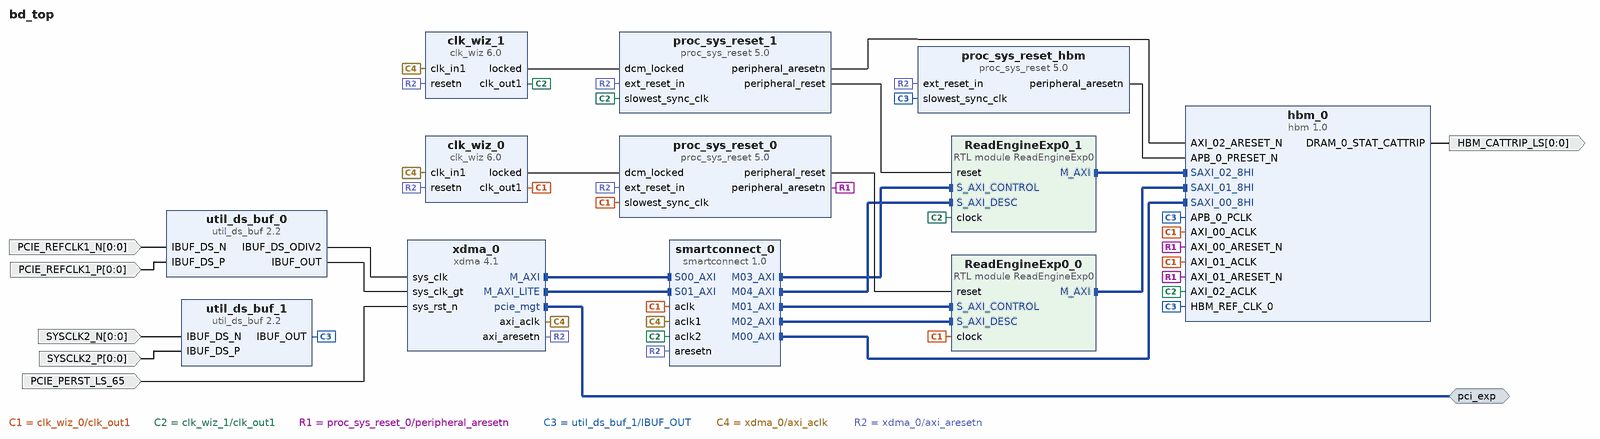
[diagram p0: block diagram of the top level]
# Vivado block design bd_top, xcu55c-fsvh2892-2L-e, Vivado 2024.1
create_bd_design bd_top

create_bd_intf_port -mode Master -vlnv xilinx.com:interface:pcie_7x_mgt_rtl:1.0 pci_exp
create_bd_port -dir I -from 0 -to 0 -type clk PCIE_REFCLK1_P
set_property -dict {CONFIG.ASSOCIATED_RESET PCIE_PERST} [get_bd_ports PCIE_REFCLK1_P]
create_bd_port -dir I -from 0 -to 0 -type clk PCIE_REFCLK1_N
create_bd_port -dir I -type rst PCIE_PERST_LS_65
create_bd_port -dir O -from 0 -to 0 HBM_CATTRIP_LS
create_bd_port -dir I -from 0 -to 0 -type clk SYSCLK2_P
create_bd_port -dir I -from 0 -to 0 -type clk SYSCLK2_N

create_bd_cell -type ip -vlnv xilinx.com:ip:clk_wiz:6.0 clk_wiz_0
set_property -dict [list \
  CONFIG.CLKIN1_JITTER_PS 40.0 \
  CONFIG.CLKOUT1_JITTER 104.289 \
  CONFIG.CLKOUT1_PHASE_ERROR 153.873 \
  CONFIG.CLKOUT1_REQUESTED_OUT_FREQ 450 \
  CONFIG.MMCM_CLKFBOUT_MULT_F 23.625 \
  CONFIG.MMCM_CLKIN1_PERIOD 4.000 \
  CONFIG.MMCM_CLKIN2_PERIOD 10.0 \
  CONFIG.MMCM_CLKOUT0_DIVIDE_F 2.625 \
  CONFIG.MMCM_DIVCLK_DIVIDE 5 \
  CONFIG.OPTIMIZE_CLOCKING_STRUCTURE_EN true \
  CONFIG.RESET_PORT resetn \
  CONFIG.RESET_TYPE ACTIVE_LOW \
] [get_bd_cells clk_wiz_0]
create_bd_cell -type ip -vlnv xilinx.com:ip:proc_sys_reset:5.0 proc_sys_reset_hbm
create_bd_cell -type ip -vlnv xilinx.com:ip:util_ds_buf:2.2 util_ds_buf_0
set_property -dict {CONFIG.C_BUF_TYPE IBUFDSGTE} [get_bd_cells util_ds_buf_0]
create_bd_cell -type ip -vlnv xilinx.com:ip:util_ds_buf:2.2 util_ds_buf_1
create_bd_cell -type ip -vlnv xilinx.com:ip:xdma:4.1 xdma_0
set_property -dict [list \
  CONFIG.PF0_DEVICE_ID_mqdma 902F \
  CONFIG.PF0_SRIOV_VF_DEVICE_ID A03F \
  CONFIG.PF2_DEVICE_ID_mqdma 922F \
  CONFIG.PF3_DEVICE_ID_mqdma 932F \
  CONFIG.axi_data_width 256_bit \
  CONFIG.axil_master_64bit_en true \
  CONFIG.axilite_master_en true \
  CONFIG.axilite_master_scale Megabytes \
  CONFIG.axilite_master_size 16 \
  CONFIG.axist_bypass_en false \
  CONFIG.axisten_freq 250 \
  CONFIG.cfg_mgmt_if false \
  CONFIG.pcie_blk_locn PCIE4C_X1Y0 \
  CONFIG.pcie_extended_tag true \
  CONFIG.pciebar2axibar_axil_master 0 \
  CONFIG.pf0_device_id 902F \
  CONFIG.pf0_link_status_slot_clock_config false \
  CONFIG.pf0_msi_cap_multimsgcap 1_vector \
  CONFIG.pf0_msi_enabled true \
  CONFIG.pf0_msix_enabled false \
  CONFIG.pl_link_cap_max_link_speed 5.0_GT/s \
  CONFIG.pl_link_cap_max_link_width X16 \
  CONFIG.plltype QPLL1 \
  CONFIG.xdma_num_usr_irq 16 \
] [get_bd_cells xdma_0]
create_bd_cell -type ip -vlnv xilinx.com:ip:smartconnect:1.0 smartconnect_0
set_property -dict {CONFIG.HAS_ARESETN 1 CONFIG.NUM_CLKS 3 CONFIG.NUM_MI 5} [get_bd_cells smartconnect_0]
create_bd_cell -type ip -vlnv xilinx.com:ip:hbm:1.0 hbm_0
set_property -dict [list \
  CONFIG.USER_APB_EN false \
  CONFIG.USER_CLK_SEL_LIST0 AXI_00_ACLK \
  CONFIG.USER_MC0_LOOKAHEAD_ACT false \
  CONFIG.USER_MC0_LOOKAHEAD_PCH false \
  CONFIG.USER_MC0_REORDER_EN false \
  CONFIG.USER_SAXI_01 true \
  CONFIG.USER_SAXI_02 true \
  CONFIG.USER_SAXI_03 false \
  CONFIG.USER_SAXI_04 false \
  CONFIG.USER_SAXI_05 false \
  CONFIG.USER_SAXI_06 false \
  CONFIG.USER_SAXI_07 false \
  CONFIG.USER_SAXI_08 false \
  CONFIG.USER_SAXI_09 false \
  CONFIG.USER_SAXI_10 false \
  CONFIG.USER_SAXI_11 false \
  CONFIG.USER_SAXI_12 false \
  CONFIG.USER_SAXI_13 false \
  CONFIG.USER_SAXI_14 false \
  CONFIG.USER_SAXI_15 false \
] [get_bd_cells hbm_0]
create_bd_cell -type module -reference ReadEngineExp0 ReadEngineExp0_0
create_bd_cell -type module -reference ReadEngineExp0 ReadEngineExp0_1
create_bd_cell -type ip -vlnv xilinx.com:ip:clk_wiz:6.0 clk_wiz_1
set_property -dict [list \
  CONFIG.CLKOUT1_JITTER 111.430 \
  CONFIG.CLKOUT1_REQUESTED_OUT_FREQ 300 \
  CONFIG.MMCM_CLKOUT0_DIVIDE_F 4.000 \
  CONFIG.RESET_PORT resetn \
  CONFIG.RESET_TYPE ACTIVE_LOW \
] [get_bd_cells clk_wiz_1]
create_bd_cell -type ip -vlnv xilinx.com:ip:proc_sys_reset:5.0 proc_sys_reset_0
create_bd_cell -type ip -vlnv xilinx.com:ip:proc_sys_reset:5.0 proc_sys_reset_1

# ---- connections ----

connect_bd_intf_net [get_bd_intf_pins hbm_0/SAXI_01_8HI] [get_bd_intf_pins ReadEngineExp0_0/M_AXI]
connect_bd_intf_net [get_bd_intf_pins ReadEngineExp0_1/M_AXI] [get_bd_intf_pins hbm_0/SAXI_02_8HI]
connect_bd_intf_net [get_bd_intf_pins smartconnect_0/M00_AXI] [get_bd_intf_pins hbm_0/SAXI_00_8HI]
connect_bd_intf_net [get_bd_intf_pins smartconnect_0/M01_AXI] [get_bd_intf_pins ReadEngineExp0_0/S_AXI_CONTROL]
connect_bd_intf_net [get_bd_intf_pins smartconnect_0/M02_AXI] [get_bd_intf_pins ReadEngineExp0_0/S_AXI_DESC]
connect_bd_intf_net [get_bd_intf_pins ReadEngineExp0_1/S_AXI_CONTROL] [get_bd_intf_pins smartconnect_0/M03_AXI]
connect_bd_intf_net [get_bd_intf_pins ReadEngineExp0_1/S_AXI_DESC] [get_bd_intf_pins smartconnect_0/M04_AXI]
connect_bd_intf_net [get_bd_intf_pins smartconnect_0/S00_AXI] [get_bd_intf_pins xdma_0/M_AXI]
connect_bd_intf_net [get_bd_intf_pins smartconnect_0/S01_AXI] [get_bd_intf_pins xdma_0/M_AXI_LITE]
connect_bd_intf_net [get_bd_intf_ports pci_exp] [get_bd_intf_pins xdma_0/pcie_mgt]
connect_bd_net -net IBUF_DS_N_0_1 [get_bd_ports PCIE_REFCLK1_N] [get_bd_pins util_ds_buf_0/IBUF_DS_N]
connect_bd_net -net IBUF_DS_N_0_2 [get_bd_ports SYSCLK2_N] [get_bd_pins util_ds_buf_1/IBUF_DS_N]
connect_bd_net -net IBUF_DS_P_0_1 [get_bd_ports PCIE_REFCLK1_P] [get_bd_pins util_ds_buf_0/IBUF_DS_P]
connect_bd_net -net IBUF_DS_P_0_2 [get_bd_ports SYSCLK2_P] [get_bd_pins util_ds_buf_1/IBUF_DS_P]
connect_bd_net [get_bd_pins clk_wiz_0/clk_out1] \
  [get_bd_pins smartconnect_0/aclk] [get_bd_pins hbm_0/AXI_00_ACLK] [get_bd_pins hbm_0/AXI_01_ACLK] \
  [get_bd_pins ReadEngineExp0_0/clock] [get_bd_pins proc_sys_reset_0/slowest_sync_clk]
connect_bd_net [get_bd_pins clk_wiz_0/locked] [get_bd_pins proc_sys_reset_0/dcm_locked]
connect_bd_net [get_bd_pins clk_wiz_1/clk_out1] \
  [get_bd_pins ReadEngineExp0_1/clock] [get_bd_pins proc_sys_reset_1/slowest_sync_clk] [get_bd_pins hbm_0/AXI_02_ACLK] \
  [get_bd_pins smartconnect_0/aclk2]
connect_bd_net [get_bd_pins clk_wiz_1/locked] [get_bd_pins proc_sys_reset_1/dcm_locked]
connect_bd_net [get_bd_pins hbm_0/DRAM_0_STAT_CATTRIP] [get_bd_ports HBM_CATTRIP_LS]
connect_bd_net -net proc_sys_reset_0_peripheral_aresetn [get_bd_pins proc_sys_reset_hbm/peripheral_aresetn] [get_bd_pins hbm_0/APB_0_PRESET_N]
connect_bd_net [get_bd_pins proc_sys_reset_0/peripheral_reset] [get_bd_pins ReadEngineExp0_0/reset]
connect_bd_net [get_bd_pins proc_sys_reset_1/peripheral_aresetn] [get_bd_pins hbm_0/AXI_02_ARESET_N]
connect_bd_net [get_bd_pins proc_sys_reset_1/peripheral_reset] [get_bd_pins ReadEngineExp0_1/reset]
connect_bd_net -net proc_sys_reset_hbm_peripheral_aresetn [get_bd_pins proc_sys_reset_0/peripheral_aresetn] \
  [get_bd_pins hbm_0/AXI_00_ARESET_N] [get_bd_pins hbm_0/AXI_01_ARESET_N]
connect_bd_net -net sys_rst_n_0_1 [get_bd_ports PCIE_PERST_LS_65] [get_bd_pins xdma_0/sys_rst_n]
connect_bd_net [get_bd_pins util_ds_buf_0/IBUF_DS_ODIV2] [get_bd_pins xdma_0/sys_clk]
connect_bd_net [get_bd_pins util_ds_buf_0/IBUF_OUT] [get_bd_pins xdma_0/sys_clk_gt]
connect_bd_net [get_bd_pins util_ds_buf_1/IBUF_OUT] \
  [get_bd_pins proc_sys_reset_hbm/slowest_sync_clk] [get_bd_pins hbm_0/HBM_REF_CLK_0] [get_bd_pins hbm_0/APB_0_PCLK]
connect_bd_net [get_bd_pins xdma_0/axi_aclk] [get_bd_pins clk_wiz_0/clk_in1] [get_bd_pins smartconnect_0/aclk1] [get_bd_pins clk_wiz_1/clk_in1]
connect_bd_net [get_bd_pins xdma_0/axi_aresetn] \
  [get_bd_pins clk_wiz_0/resetn] [get_bd_pins proc_sys_reset_hbm/ext_reset_in] [get_bd_pins smartconnect_0/aresetn] \
  [get_bd_pins proc_sys_reset_0/ext_reset_in] [get_bd_pins proc_sys_reset_1/ext_reset_in] [get_bd_pins clk_wiz_1/resetn]

# ---- address map ----
assign_bd_address -offset 0x000000000 -range 512M -target_address_space [get_bd_addr_spaces ReadEngineExp0_0/M_AXI] [get_bd_addr_segs hbm_0/SAXI_01_8HI/HBM_MEM00]
assign_bd_address -offset 0x020000000 -range 512M -target_address_space [get_bd_addr_spaces ReadEngineExp0_0/M_AXI] [get_bd_addr_segs hbm_0/SAXI_01_8HI/HBM_MEM01]
assign_bd_address -offset 0x040000000 -range 512M -target_address_space [get_bd_addr_spaces ReadEngineExp0_0/M_AXI] [get_bd_addr_segs hbm_0/SAXI_01_8HI/HBM_MEM02]
assign_bd_address -offset 0x060000000 -range 512M -target_address_space [get_bd_addr_spaces ReadEngineExp0_0/M_AXI] [get_bd_addr_segs hbm_0/SAXI_01_8HI/HBM_MEM03]
assign_bd_address -offset 0x080000000 -range 512M -target_address_space [get_bd_addr_spaces ReadEngineExp0_0/M_AXI] [get_bd_addr_segs hbm_0/SAXI_01_8HI/HBM_MEM04]
assign_bd_address -offset 0x0A0000000 -range 512M -target_address_space [get_bd_addr_spaces ReadEngineExp0_0/M_AXI] [get_bd_addr_segs hbm_0/SAXI_01_8HI/HBM_MEM05]
assign_bd_address -offset 0x0C0000000 -range 512M -target_address_space [get_bd_addr_spaces ReadEngineExp0_0/M_AXI] [get_bd_addr_segs hbm_0/SAXI_01_8HI/HBM_MEM06]
assign_bd_address -offset 0x0E0000000 -range 512M -target_address_space [get_bd_addr_spaces ReadEngineExp0_0/M_AXI] [get_bd_addr_segs hbm_0/SAXI_01_8HI/HBM_MEM07]
assign_bd_address -offset 0x100000000 -range 512M -target_address_space [get_bd_addr_spaces ReadEngineExp0_0/M_AXI] [get_bd_addr_segs hbm_0/SAXI_01_8HI/HBM_MEM08]
assign_bd_address -offset 0x120000000 -range 512M -target_address_space [get_bd_addr_spaces ReadEngineExp0_0/M_AXI] [get_bd_addr_segs hbm_0/SAXI_01_8HI/HBM_MEM09]
assign_bd_address -offset 0x140000000 -range 512M -target_address_space [get_bd_addr_spaces ReadEngineExp0_0/M_AXI] [get_bd_addr_segs hbm_0/SAXI_01_8HI/HBM_MEM10]
assign_bd_address -offset 0x160000000 -range 512M -target_address_space [get_bd_addr_spaces ReadEngineExp0_0/M_AXI] [get_bd_addr_segs hbm_0/SAXI_01_8HI/HBM_MEM11]
assign_bd_address -offset 0x180000000 -range 512M -target_address_space [get_bd_addr_spaces ReadEngineExp0_0/M_AXI] [get_bd_addr_segs hbm_0/SAXI_01_8HI/HBM_MEM12]
assign_bd_address -offset 0x1A0000000 -range 512M -target_address_space [get_bd_addr_spaces ReadEngineExp0_0/M_AXI] [get_bd_addr_segs hbm_0/SAXI_01_8HI/HBM_MEM13]
assign_bd_address -offset 0x1C0000000 -range 512M -target_address_space [get_bd_addr_spaces ReadEngineExp0_0/M_AXI] [get_bd_addr_segs hbm_0/SAXI_01_8HI/HBM_MEM14]
assign_bd_address -offset 0x1E0000000 -range 512M -target_address_space [get_bd_addr_spaces ReadEngineExp0_0/M_AXI] [get_bd_addr_segs hbm_0/SAXI_01_8HI/HBM_MEM15]
assign_bd_address -offset 0x000000000 -range 512M -target_address_space [get_bd_addr_spaces ReadEngineExp0_1/M_AXI] [get_bd_addr_segs hbm_0/SAXI_02_8HI/HBM_MEM00]
assign_bd_address -offset 0x020000000 -range 512M -target_address_space [get_bd_addr_spaces ReadEngineExp0_1/M_AXI] [get_bd_addr_segs hbm_0/SAXI_02_8HI/HBM_MEM01]
assign_bd_address -offset 0x040000000 -range 512M -target_address_space [get_bd_addr_spaces ReadEngineExp0_1/M_AXI] [get_bd_addr_segs hbm_0/SAXI_02_8HI/HBM_MEM02]
assign_bd_address -offset 0x060000000 -range 512M -target_address_space [get_bd_addr_spaces ReadEngineExp0_1/M_AXI] [get_bd_addr_segs hbm_0/SAXI_02_8HI/HBM_MEM03]
assign_bd_address -offset 0x080000000 -range 512M -target_address_space [get_bd_addr_spaces ReadEngineExp0_1/M_AXI] [get_bd_addr_segs hbm_0/SAXI_02_8HI/HBM_MEM04]
assign_bd_address -offset 0x0A0000000 -range 512M -target_address_space [get_bd_addr_spaces ReadEngineExp0_1/M_AXI] [get_bd_addr_segs hbm_0/SAXI_02_8HI/HBM_MEM05]
assign_bd_address -offset 0x0C0000000 -range 512M -target_address_space [get_bd_addr_spaces ReadEngineExp0_1/M_AXI] [get_bd_addr_segs hbm_0/SAXI_02_8HI/HBM_MEM06]
assign_bd_address -offset 0x0E0000000 -range 512M -target_address_space [get_bd_addr_spaces ReadEngineExp0_1/M_AXI] [get_bd_addr_segs hbm_0/SAXI_02_8HI/HBM_MEM07]
assign_bd_address -offset 0x100000000 -range 512M -target_address_space [get_bd_addr_spaces ReadEngineExp0_1/M_AXI] [get_bd_addr_segs hbm_0/SAXI_02_8HI/HBM_MEM08]
assign_bd_address -offset 0x120000000 -range 512M -target_address_space [get_bd_addr_spaces ReadEngineExp0_1/M_AXI] [get_bd_addr_segs hbm_0/SAXI_02_8HI/HBM_MEM09]
assign_bd_address -offset 0x140000000 -range 512M -target_address_space [get_bd_addr_spaces ReadEngineExp0_1/M_AXI] [get_bd_addr_segs hbm_0/SAXI_02_8HI/HBM_MEM10]
assign_bd_address -offset 0x160000000 -range 512M -target_address_space [get_bd_addr_spaces ReadEngineExp0_1/M_AXI] [get_bd_addr_segs hbm_0/SAXI_02_8HI/HBM_MEM11]
assign_bd_address -offset 0x180000000 -range 512M -target_address_space [get_bd_addr_spaces ReadEngineExp0_1/M_AXI] [get_bd_addr_segs hbm_0/SAXI_02_8HI/HBM_MEM12]
assign_bd_address -offset 0x1A0000000 -range 512M -target_address_space [get_bd_addr_spaces ReadEngineExp0_1/M_AXI] [get_bd_addr_segs hbm_0/SAXI_02_8HI/HBM_MEM13]
assign_bd_address -offset 0x1C0000000 -range 512M -target_address_space [get_bd_addr_spaces ReadEngineExp0_1/M_AXI] [get_bd_addr_segs hbm_0/SAXI_02_8HI/HBM_MEM14]
assign_bd_address -offset 0x1E0000000 -range 512M -target_address_space [get_bd_addr_spaces ReadEngineExp0_1/M_AXI] [get_bd_addr_segs hbm_0/SAXI_02_8HI/HBM_MEM15]
assign_bd_address -offset 0x0000000000008000 -range 32K -target_address_space [get_bd_addr_spaces xdma_0/M_AXI] [get_bd_addr_segs ReadEngineExp0_0/S_AXI_DESC/reg0]
assign_bd_address -offset 0x0000000000018000 -range 32K -target_address_space [get_bd_addr_spaces xdma_0/M_AXI] [get_bd_addr_segs ReadEngineExp0_1/S_AXI_DESC/reg0]
assign_bd_address -offset 0x0000000020000000 -range 512M -target_address_space [get_bd_addr_spaces xdma_0/M_AXI] [get_bd_addr_segs hbm_0/SAXI_00_8HI/HBM_MEM01]
assign_bd_address -offset 0x0000000040000000 -range 512M -target_address_space [get_bd_addr_spaces xdma_0/M_AXI] [get_bd_addr_segs hbm_0/SAXI_00_8HI/HBM_MEM02]
assign_bd_address -offset 0x0000000060000000 -range 512M -target_address_space [get_bd_addr_spaces xdma_0/M_AXI] [get_bd_addr_segs hbm_0/SAXI_00_8HI/HBM_MEM03]
assign_bd_address -offset 0x0000000080000000 -range 512M -target_address_space [get_bd_addr_spaces xdma_0/M_AXI] [get_bd_addr_segs hbm_0/SAXI_00_8HI/HBM_MEM04]
assign_bd_address -offset 0x00000000A0000000 -range 512M -target_address_space [get_bd_addr_spaces xdma_0/M_AXI] [get_bd_addr_segs hbm_0/SAXI_00_8HI/HBM_MEM05]
assign_bd_address -offset 0x00000000C0000000 -range 512M -target_address_space [get_bd_addr_spaces xdma_0/M_AXI] [get_bd_addr_segs hbm_0/SAXI_00_8HI/HBM_MEM06]
assign_bd_address -offset 0x00000000E0000000 -range 512M -target_address_space [get_bd_addr_spaces xdma_0/M_AXI] [get_bd_addr_segs hbm_0/SAXI_00_8HI/HBM_MEM07]
assign_bd_address -offset 0x0000000100000000 -range 512M -target_address_space [get_bd_addr_spaces xdma_0/M_AXI] [get_bd_addr_segs hbm_0/SAXI_00_8HI/HBM_MEM08]
assign_bd_address -offset 0x0000000120000000 -range 512M -target_address_space [get_bd_addr_spaces xdma_0/M_AXI] [get_bd_addr_segs hbm_0/SAXI_00_8HI/HBM_MEM09]
assign_bd_address -offset 0x0000000140000000 -range 512M -target_address_space [get_bd_addr_spaces xdma_0/M_AXI] [get_bd_addr_segs hbm_0/SAXI_00_8HI/HBM_MEM10]
assign_bd_address -offset 0x0000000160000000 -range 512M -target_address_space [get_bd_addr_spaces xdma_0/M_AXI] [get_bd_addr_segs hbm_0/SAXI_00_8HI/HBM_MEM11]
assign_bd_address -offset 0x0000000180000000 -range 512M -target_address_space [get_bd_addr_spaces xdma_0/M_AXI] [get_bd_addr_segs hbm_0/SAXI_00_8HI/HBM_MEM12]
assign_bd_address -offset 0x00000001A0000000 -range 512M -target_address_space [get_bd_addr_spaces xdma_0/M_AXI] [get_bd_addr_segs hbm_0/SAXI_00_8HI/HBM_MEM13]
assign_bd_address -offset 0x00000001C0000000 -range 512M -target_address_space [get_bd_addr_spaces xdma_0/M_AXI] [get_bd_addr_segs hbm_0/SAXI_00_8HI/HBM_MEM14]
assign_bd_address -offset 0x00000001E0000000 -range 512M -target_address_space [get_bd_addr_spaces xdma_0/M_AXI] [get_bd_addr_segs hbm_0/SAXI_00_8HI/HBM_MEM15]
exclude_bd_addr_seg -offset 0x0000000000000000 -range 4K -target_address_space [get_bd_addr_spaces xdma_0/M_AXI] [get_bd_addr_segs ReadEngineExp0_0/S_AXI_CONTROL/reg0]
exclude_bd_addr_seg -offset 0x0000000000000000 -range 512M -target_address_space [get_bd_addr_spaces xdma_0/M_AXI] [get_bd_addr_segs hbm_0/SAXI_00_8HI/HBM_MEM00]
exclude_bd_addr_seg -offset 0x0000000000010000 -range 4K -target_address_space [get_bd_addr_spaces xdma_0/M_AXI] [get_bd_addr_segs ReadEngineExp0_1/S_AXI_CONTROL/reg0]
assign_bd_address -offset 0x00000000 -range 4K -target_address_space [get_bd_addr_spaces xdma_0/M_AXI_LITE] [get_bd_addr_segs ReadEngineExp0_0/S_AXI_CONTROL/reg0]
assign_bd_address -offset 0x00010000 -range 4K -target_address_space [get_bd_addr_spaces xdma_0/M_AXI_LITE] [get_bd_addr_segs ReadEngineExp0_1/S_AXI_CONTROL/reg0]
exclude_bd_addr_seg -offset 0x00000000 -range 32K -target_address_space [get_bd_addr_spaces xdma_0/M_AXI_LITE] [get_bd_addr_segs ReadEngineExp0_0/S_AXI_DESC/reg0]
exclude_bd_addr_seg -offset 0x00000000 -range 512M -target_address_space [get_bd_addr_spaces xdma_0/M_AXI_LITE] [get_bd_addr_segs hbm_0/SAXI_00_8HI/HBM_MEM00]
exclude_bd_addr_seg -offset 0x00018000 -range 32K -target_address_space [get_bd_addr_spaces xdma_0/M_AXI_LITE] [get_bd_addr_segs ReadEngineExp0_1/S_AXI_DESC/reg0]
exclude_bd_addr_seg -offset 0x20000000 -range 512M -target_address_space [get_bd_addr_spaces xdma_0/M_AXI_LITE] [get_bd_addr_segs hbm_0/SAXI_00_8HI/HBM_MEM01]
exclude_bd_addr_seg -offset 0x40000000 -range 512M -target_address_space [get_bd_addr_spaces xdma_0/M_AXI_LITE] [get_bd_addr_segs hbm_0/SAXI_00_8HI/HBM_MEM02]
exclude_bd_addr_seg -offset 0x60000000 -range 512M -target_address_space [get_bd_addr_spaces xdma_0/M_AXI_LITE] [get_bd_addr_segs hbm_0/SAXI_00_8HI/HBM_MEM03]
exclude_bd_addr_seg -offset 0x80000000 -range 512M -target_address_space [get_bd_addr_spaces xdma_0/M_AXI_LITE] [get_bd_addr_segs hbm_0/SAXI_00_8HI/HBM_MEM04]
exclude_bd_addr_seg -offset 0xA0000000 -range 512M -target_address_space [get_bd_addr_spaces xdma_0/M_AXI_LITE] [get_bd_addr_segs hbm_0/SAXI_00_8HI/HBM_MEM05]
exclude_bd_addr_seg -offset 0xC0000000 -range 512M -target_address_space [get_bd_addr_spaces xdma_0/M_AXI_LITE] [get_bd_addr_segs hbm_0/SAXI_00_8HI/HBM_MEM06]
exclude_bd_addr_seg -offset 0xE0000000 -range 512M -target_address_space [get_bd_addr_spaces xdma_0/M_AXI_LITE] [get_bd_addr_segs hbm_0/SAXI_00_8HI/HBM_MEM07]
exclude_bd_addr_seg -offset 0x000100000000 -range 512M -target_address_space [get_bd_addr_spaces xdma_0/M_AXI_LITE] [get_bd_addr_segs hbm_0/SAXI_00_8HI/HBM_MEM08]
exclude_bd_addr_seg -offset 0x120000000 -range 512M -target_address_space [get_bd_addr_spaces xdma_0/M_AXI_LITE] [get_bd_addr_segs hbm_0/SAXI_00_8HI/HBM_MEM09]
exclude_bd_addr_seg -offset 0x140000000 -range 512M -target_address_space [get_bd_addr_spaces xdma_0/M_AXI_LITE] [get_bd_addr_segs hbm_0/SAXI_00_8HI/HBM_MEM10]
exclude_bd_addr_seg -offset 0x160000000 -range 512M -target_address_space [get_bd_addr_spaces xdma_0/M_AXI_LITE] [get_bd_addr_segs hbm_0/SAXI_00_8HI/HBM_MEM11]
exclude_bd_addr_seg -offset 0x180000000 -range 512M -target_address_space [get_bd_addr_spaces xdma_0/M_AXI_LITE] [get_bd_addr_segs hbm_0/SAXI_00_8HI/HBM_MEM12]
exclude_bd_addr_seg -offset 0x1A0000000 -range 512M -target_address_space [get_bd_addr_spaces xdma_0/M_AXI_LITE] [get_bd_addr_segs hbm_0/SAXI_00_8HI/HBM_MEM13]
exclude_bd_addr_seg -offset 0x1C0000000 -range 512M -target_address_space [get_bd_addr_spaces xdma_0/M_AXI_LITE] [get_bd_addr_segs hbm_0/SAXI_00_8HI/HBM_MEM14]
exclude_bd_addr_seg -offset 0x1E0000000 -range 512M -target_address_space [get_bd_addr_spaces xdma_0/M_AXI_LITE] [get_bd_addr_segs hbm_0/SAXI_00_8HI/HBM_MEM15]

validate_bd_design
save_bd_design
